# Altium schematic sheet Supply_ (1).SchDoc
size A4
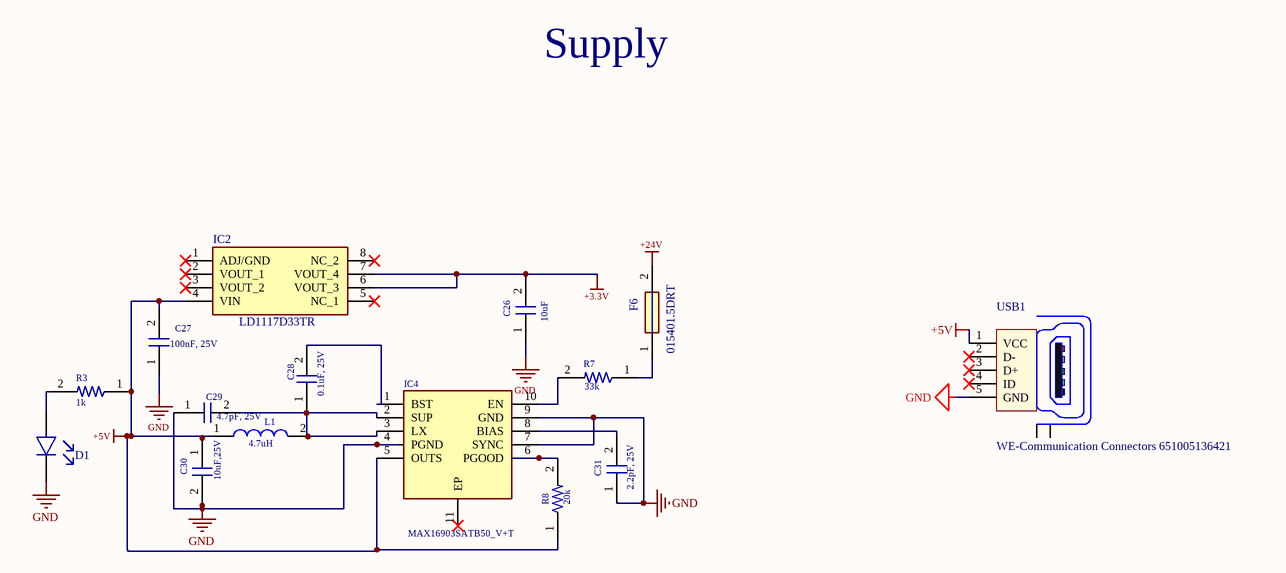
[diagram p0: Supply_ (1).SchDoc]

## Parts
C26  10uF  [C 1206]
C27  100nF, 25V  [C 1206]
C28  0.1uF, 25V  [C 1206]
C29  4.7pF, 25V  [C 1206]
C30  10uF,25V  [C 1206]
C31  2.2pF, 25V  [C 1206]
D1  Valor  [LED 0805]  (value not drawn)
F6  015401.5DRT  [Fuse Holder]
IC2  LD1117D33TR  [SOIC127P600X175-8N]
IC4  MAX16903SATB50_V+T  [SON50P300X300X80-11N]
L1  4.7uH  [MPX1D0530L150]
R3  1k  [R 0201]
R7  33k  [R 0805]
R8  20k  [R 0805]
USB1  WE-Communication Connectors 651005136421  [65100516121]

## Nets
+3.3V: C26.2 IC2.6(VOUT_3) IC2.7(VOUT_4)
+5V: C27.2 C30.1 IC2.4(VIN) IC4.5(OUTS) L1.1 R3.1 R8.1 USB1.1(VCC)
+24V: F6.2
GND: C26.1 C27.1 C29.1 C30.2 C31.1 D1.1 IC4.4(PGND) IC4.7(SYNC) IC4.9(GND) USB1.5(GND)
NetC28_1: C28.1 C29.2 IC4.2(SUP) IC4.3(LX) L1.2
NetC28_2: C28.2 IC4.1(BST)
NetC31_2: C31.2 IC4.8(BIAS)
NetD1_2: D1.2 R3.2
NetF6_1: F6.1 R7.1
NetIC4_6: IC4.6(PGOOD) R8.2
NetIC4_10: IC4.10(EN) R7.2

Not connected (* = marked no-connect by the designer): IC2 1(ADJ/GND)* 2(VOUT_1)* 3(VOUT_2)* 5(NC_1)* 8(NC_2)*; IC4 11(EP)*; USB1 2(D-)* 3(D+)* 4(ID)* Z1(Shield) Z2(Shield)

## Notes on the sheet
- Supply

## Library data of the parts
C26-C31 = Condensador
D1 = LED
F6 = 015401.5DRT: Fuse; Manufacturer_Name: LITTELFUSE; Datasheet Link: https://componentsearchengine.com/Datasheets/2/015401.5DRT.pdf; Height: 3.81mm; Manufacturer_Part_Number: 015401.5DRT; Mouser Part Number: 576-015401.5DRT; Mouser Price/Stock: https://www.mouser.co.uk/ProductDetail/Littelfuse/015401.5DRT?qs=gu7KAQ731USSn8iq6YrVPw%3D%3D; Arrow Part Number: 015401.5DRT; Arrow Price/Stock: https://www.arrow.com/en/products/015401.5drt/littelfuse?region=nac
IC2 = LD1117D33TR: Integrated Circuit; Manufacturer_Name: STMicroelectronics; Datasheet Link: http://www.st.com/st-web-ui/static/active/en/resource/technical/document/datasheet/CD00000544.pdf; Height: 1.75mm; Manufacturer_Part_Number: LD1117D33TR; Mouser Part Number: 511-LD1117D33-TR; Mouser Price/Stock: https://www.mouser.co.uk/ProductDetail/STMicroelectronics/LD1117D33TR?qs=8YYpzd7qSxIl%2FiC6F%2FA2nA%3D%3D; Arrow Part Number: LD1117D33TR; Arrow Price/Stock: https://www.arrow.com/en/products/ld1117d33tr/stmicroelectronics
IC4 = MAX16903SATB50_V+T: Integrated Circuit; Manufacturer_Name: Maxim Integrated; Manufacturer_Part_Number: MAX16903SATB50/V+T; Datasheet Link: https://pdfserv.maximintegrated.com/en/ds/MAX16903.pdf; Height: 0.8mm
L1 = Inductor
R3 R7 R8 = Resistencia
USB1 = WE-Communication Connectors 651005136421: WR-COM Mini USB Vertical TH Type B 5 Contacts; Manufacturer: Würth Elektronik eiSos GmbH; ComponentLink1 Description: Manufacturer; ComponentLink2 Description: Datasheet; NoPins: 5; ComponentLink1URL: http://www.we-online.de; ComponentLink2URL: http://katalog.we-online.de/em/datasheet/651005136421.pdf; Created by: Karrer Zheng; Created Date: 10/10/2014; partNo: 651005136421